# Altium schematic sheet Vapeix_mini_connector.SchDoc: Vapeix Mini PCB - Connectors
size A3; DrawnBy: Jon; Organization: Altium Limited; Address1: L3, 12a Rodborough Rd; Address2: Frenchs Forest; Address3: NSW; Address4: Australia 2086
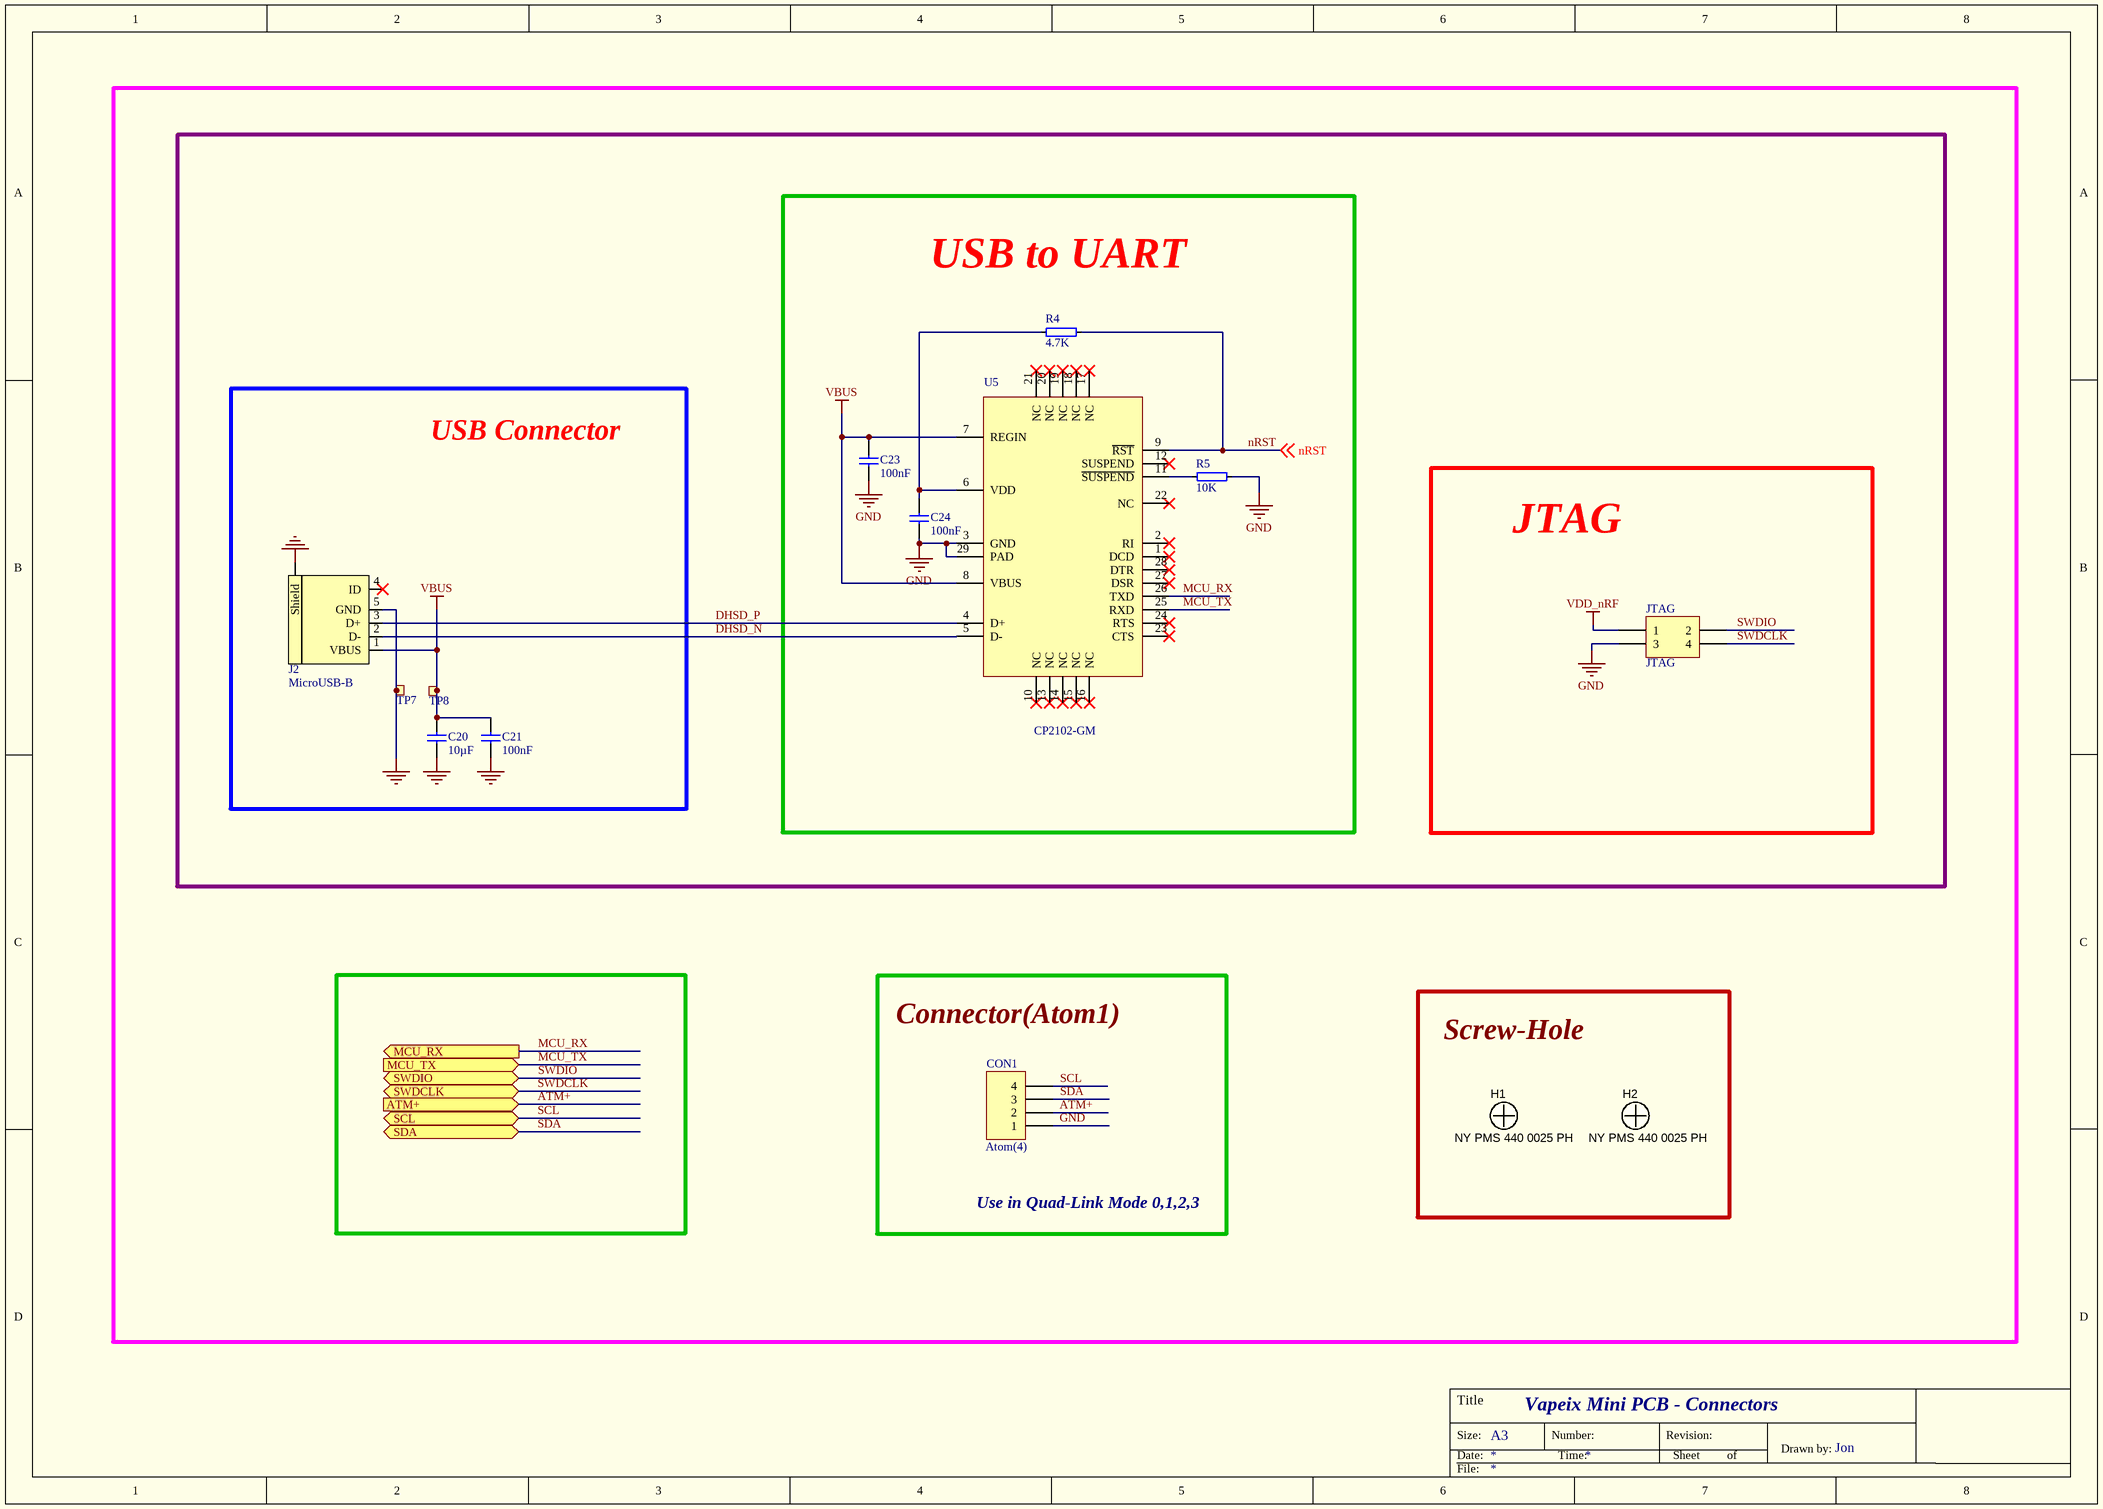
[diagram p0: Vapeix_mini_connector.SchDoc]

## Parts
C20  10µF  [C0201]
C21  100nF  [C0201]
C23  100nF  [C0201]
C24  100nF  [C0201]
CON1  Atom(4)  [S4B-PH-K-S]
H1  NY PMS 440 0025 PH  [SCREW_HOLE2]
H2  NY PMS 440 0025 PH  [SCREW_HOLE2]
J2  MicroUSB-B  [FCI_10118193-0001LF]
JTAG  JTAG  [CON4]
R4  4.7K  [R0201]
R5  10K  [C0201]
TP7  Ø1.0mm,SMD  [TP_SMD_Ø1.0mm]  (value not drawn)  (no BOM)
TP8  Ø1.0mm,SMD  [TP_SMD_Ø1.0mm]  (value not drawn)  (no BOM)
U5  CP2102-GM  [CP2102-GM]

## Ports
ATM+ (in), MCU_RX (out), MCU_TX (in), SCL (bidir), SDA (bidir), SWDCLK, SWDIO (bidir)

## Nets
GND: C20.1 C21.1 C23.1 C24.1 CON1.1 J2.5(GND) J2.6(Shield) JTAG.3 R5.2 TP7.1 U5.3(GND) U5.29(PAD)
VBUS: C20.2 C21.2 C23.2 J2.1(VBUS) TP8.1 U5.7(REGIN) U5.8(VBUS)
VDD_nRF: JTAG.1
ATM+: CON1.2 ; port ATM+
DHSD_N: J2.2(D-) U5.5(D-)
DHSD_P: J2.3(D+) U5.4(D+)
MCU_RX: U5.26(TXD) ; port MCU_RX
MCU_TX: U5.25(RXD) ; port MCU_TX
nRST: R4.2 U5.9(~{RST}) ; off-sheet nRST
SCL: CON1.4 ; port SCL
SDA: CON1.3 ; port SDA
SWDCLK: JTAG.4 ; port SWDCLK
SWDIO: JTAG.2 ; port SWDIO
NetC24_2: C24.2 R4.1 U5.6(VDD)
NetR5_1: R5.1 U5.11(~{SUSPEND})

Not connected (* = marked no-connect by the designer): J2 4(ID)*; U5 1(DCD)* 2(RI)* 10(NC)* 12(SUSPEND)* 13(NC)* 14(NC)* 15(NC)* 16(NC)* 17(NC)* 18(NC)* 19(NC)* 20(NC)* 21(NC)* 22(NC)* 23(CTS)* 24(RTS)* 27(DSR)* 28(DTR)*

## Notes on the sheet
- Labels drawn without touching a wire or pin: Connector(Atom1), JTAG, Screw-Hole, USB Connector, USB to UART, Use in Quad-Link Mode 0,1,2,3
- Title
- Size:
- Date:
- A3
- Number:
- Time:
- Revision:
- Sheet
- of
- Drawn by:
- File:

## Library data of the parts
C20 = C0603-10µ: Capacitor, X5R, ±20%; Note: 6.3V; Artikkelnr Noca: 20039234; Artikkelnr Simpro: N.A.; Part Number: C0603-10µ; Manufacturer: *; Manufacturer Part Number: *; Datasheet: *; LatestRevisionDate: 2011-01-17; Pin Count: 2; Publisher: Nordic Semiconductor; Published: 2011-01-17; Value: 10µF; Supplier: *; Supplier part number: *; 2nd source Supplier: *; 2nd source part number: *; Footprint Doc: 0603
C21 C23 C24 = C0402-100n: Capacitor, X7R, ±10%; Note: 16V; Artikkelnr Noca: 20039200; Artikkelnr Simpro: N.A.; Part Number: C0402-100n; Manufacturer: *; Manufacturer Part Number: *; Datasheet: *; LatestRevisionDate: 2009-11-23; Pin Count: 2; Publisher: Nordic Semiconductor; Published: 2009-05-08; Value: 100nF; Supplier: *; Supplier part number: *; 2nd source Supplier: *; 2nd source part number: *; Footprint Doc: 0402
CON1 = S4B-PH-K-S(LF)(SN): CONN HEADER PH SIDE 4POS 2MM; Manufacturer: JST Sales America Inc.; Connector Type: Header, Shrouded; Number of Positions: 4; Number of Positions Loaded: All; Pitch: 0.079" (2.00mm); Supplier 1: Digi-Key; Manufacturer Part Number: S4B-PH-K-S(LF)(SN); RoHS: RoHS Compliant; Category: Connectors, Interconnects; Stock 1: 41576; Pricing 1: 1=0.22, 10=0.208, 25=0.1772, 50=0.155, 100=0.144, 250=0.1274, 500=0.12186, 1000=0.0997, 2500=0.09139 (USD); Packaging: Bulk; Contact Type: Male Pin; Number of Rows: 1; Row Spacing: -; Contact Mating Length: 0.130" (3.30mm); Mounting Type: Through Hole, Right Angle; Termination: Press-Fit, Solder; Fastening Type: Detent Lock; Features: -; Contact Finish: Tin; Contact Finish Thickness: -; Color: Natural; ComponentLink1URL: http://www.jst-mfg.com/product/pdf/eng/ePH.pdf; ComponentLink1Description: http://www.jst-mfg.com/product/pdf/eng/ePH.pdf
H1 H2 = Screw-Hole: Machine Screw, Round, #4-40 x 1/4, Nylon, Philips panhead; Manufacturer: B&F Fastener Supply; Manufacturer Part Number: CP2102-GM; CompType: Hardware; SymbolCreator: codlsc; U/M: EA; USB Type: USB UART; USB Standard: USB 2.0; Supply Voltage Min: 3; Supply Voltage Max: 3.6; Interface Case Style: QFN; No. of Pins: 28; Data Rate: 1; No. of Ports: 1 Port; Base Number: 2102; Bridge Type: USB to UART; Supply Voltage Range: 3V to 5.25V<!--FANDB--><div class="features-and-benefits-container"><div class="features-and-benefits-desc-container"><span class="features-and-benefits-container-desc">USB to UART Bridge Controller in QFN-28 Package</span></div><div class="features-and-benefits-description"><span class="features-benefits-value">The CP2102-GM is a highly integrated USB to UART Bridge Controller providing a simple solution for updating RS-232 designs to USB using a minimum of components and PCB space. The CP2102-GM includes a USB 2.0 full speed function controller, USB transceiver, oscillator, EEPROM, and asynchronous serial data bus (UART) with full modem control signals. No other external USB components are required. The on chip EEPROM may be used to customise the USB Vendor ID, Product ID, Product Description String, Power Descriptor, Device Release Number, and Device Serial Number as desired for OEM applications. The EEPROM is programmed on board via the USB, allowing the programming step to be easily integrated into the product manufacturing and testing process.</span></div><div class="features-and-benefits-list"><ul class="features-and-benefits-list-list"><li class="features-and-benefits-list-item">Integrated USB transceiver; no external crystal required</li><li class="features-and-benefits-list-item">Integrated 1024 Byte EEPROM</li><li class="features-and-benefits-list-item">On chip power on reset circuit</li><li class="features-and-benefits-list-item">On chip voltage regulator: 3.3V output</li><li class="features-and-benefits-list-item">USB Specification 2.0 compliant; full-speed (12 Mbps)</li><li class="features-and-benefits-list-item">USB suspend states supported via SUSPEND pins</li><li class="features-and-benefits-list-item">All handshaking and modem interface signals</li><li class="features-and-benefits-list-item">Baud rates: 300 bps to 1 Mbits</li><li class="features-and-benefits-list-item">576 Byte receive buffer; SymbolVersion: 2009-10-28; MountType: N/A; RoHS: Y; PartNumber: NY PMS 440 0025 PH; PackageReference: Screw; DigiKeyPartNumber: H542-ND; ComponentLink1Description: Datasheet Link; ComponentLink1URL: http://www.fasnetdirect.com/refguide/Machinepancombo.pdf; ClassName: Mounting Holes; LatestRevisionDate: 2014-05-15; Publisher: Texas Instruments; Supplier 1: Digi-Key; Supplier Part Number 1: H542-ND; Supplier 4: Farnell; Stock 4: 9194; Pricing 4: 1=1.82, 10=1.72, 100=1.69, 250=1.66, 500=1.62, 2000=1.59, 3000=1.56, 5000=1.55 (GBP); Operating Temperature Min: -40; Operating Temperature Max: 85; Packaging: Each; MSL: -; Logic Function Number: 2102; Operating Temperature Range: -40°C to +85; ComponentLink2URL: http://www.farnell.com/datasheets/1694195.pdf; ComponentLink2Description: http://www.farnell.com/datasheets/1694195.pdf; Supplier Part Number 4: 9282130
J2 = FCI 10118193-0001LF: MicroUSB-B-SMT; Manufacturer: FCI; 2nd source part number: 649-10118193-0001LF; Artikkelnr Noca: N.A.; Part Number: FCI 10118193-0001LF; Manufacturer Part Number: 10118193-0001LF; Datasheet: http://portal.fciconnect.com/Comergent//fci/drawing/10118193.pdf; Footprint Doc: FCI_10118193-0001LF; LatestRevisionDate: 2014-10-07; Pin Count: 5; Publisher: Nordic Semiconductor; Published: 2014-10-07; Value: MicroUSB-B; Note: *; Supplier: Digi-Key; Supplier part number: 609-4616-1-ND; 2nd source Supplier: Mouser; Artikkelnr Simpro: N.A.
JTAG = Header 2X2: Header, 2-Pin, Dual row; LatestRevisionDate: 17-Jul-2002; LatestRevisionNote: Re-released for DXP Platform.; Publisher: Altium Limited
R4 = R0402-10k: Resistor, ±1%, 0.063W; Value: 10k; Note: Chip Res 1%; Artikkelnr Noca: 27049097; Artikkelnr Simpro: N.A.; Part Number: R0402-10k; Manufacturer: *; Manufacturer Part Number: *; Datasheet: *; LatestRevisionDate: 2009-11-23; Pin Count: 2; Publisher: Nordic Semiconductor; Published: 2009-05-08; Supplier: Farnell; Supplier part number: 173-8864; 2nd source Supplier: *; 2nd source part number: *; Footprint Doc: 0402
R5 = R0402-10k: Resistor, ±1%, 0.063W; Note: Chip Res 1%; Artikkelnr Noca: 27049097; Artikkelnr Simpro: N.A.; Value: 10k; Part Number: R0402-10k; Manufacturer: *; Manufacturer Part Number: *; Datasheet: *; LatestRevisionDate: 2009-11-23; Pin Count: 2; Publisher: Nordic Semiconductor; Published: 2009-05-08; Supplier: Farnell; Supplier part number: 173-8864; 2nd source Supplier: *; 2nd source part number: *; Footprint Doc: 0402
TP7 TP8 = TP_SMD_Ø1.0MM: 1.0mm circular SMD testpad; Manufacturer: Nordic Semiconductor; Artikkelnr Noca: N.A.; Part Number: TP_SMD_Ø1.0MM; Manufacturer Part Number: *; Datasheet: *; LatestRevisionDate: 2013-06-11; Pin Count: 1; Publisher: Nordic Semiconductor; Published: 2013-06-11; Value: Ø1.0mm,SMD; Note: *; Supplier: *; Supplier part number: *; 2nd source Supplier: *; 2nd source part number: *; Footprint Doc: TP_SMD_Ø1.0mm; Artikkelnr Simpro: N.A.
U5 = CP2102-GM: SILICON LABS - CP2102-GM - USB-TO-UART BRIDGE, 3.6V, MLP-28; USB Type: USB UART; USB Standard: USB 2.0; Supply Voltage Min: 3; Supply Voltage Max: 3.6; Interface Case Style: QFN; No. of Pins: 28; Data Rate: 1; No. of Ports: 1 Port; Base Number: 2102; Bridge Type: USB to UART; Supply Voltage Range: 3V to 5.25V<!--FANDB--><div class="features-and-benefits-container"><div class="features-and-benefits-desc-container"><span class="features-and-benefits-container-desc">USB to UART Bridge Controller in QFN-28 Package</span></div><div class="features-and-benefits-description"><span class="features-benefits-value">The CP2102-GM is a highly integrated USB to UART Bridge Controller providing a simple solution for updating RS-232 designs to USB using a minimum of components and PCB space. The CP2102-GM includes a USB 2.0 full speed function controller, USB transceiver, oscillator, EEPROM, and asynchronous serial data bus (UART) with full modem control signals. No other external USB components are required. The on chip EEPROM may be used to customise the USB Vendor ID, Product ID, Product Description String, Power Descriptor, Device Release Number, and Device Serial Number as desired for OEM applications. The EEPROM is programmed on board via the USB, allowing the programming step to be easily integrated into the product manufacturing and testing process.</span></div><div class="features-and-benefits-list"><ul class="features-and-benefits-list-list"><li class="features-and-benefits-list-item">Integrated USB transceiver; no external crystal required</li><li class="features-and-benefits-list-item">Integrated 1024 Byte EEPROM</li><li class="features-and-benefits-list-item">On chip power on reset circuit</li><li class="features-and-benefits-list-item">On chip voltage regulator: 3.3V output</li><li class="features-and-benefits-list-item">USB Specification 2.0 compliant; full-speed (12 Mbps)</li><li class="features-and-benefits-list-item">USB suspend states supported via SUSPEND pins</li><li class="features-and-benefits-list-item">All handshaking and modem interface signals</li><li class="features-and-benefits-list-item">Baud rates: 300 bps to 1 Mbits</li><li class="features-and-benefits-list-item">576 Byte receive buffer; Supplier 1: Farnell; Manufacturer: SILICON LABS; Manufacturer Part Number: CP2102-GM; RoHS: YES; Stock 1: 9194; Pricing 1: 1=1.82, 10=1.72, 100=1.69, 250=1.66, 500=1.62, 2000=1.59, 3000=1.56, 5000=1.55 (GBP); Operating Temperature Min: -40; Operating Temperature Max: 85; Packaging: Each; MSL: -; Logic Function Number: 2102; Operating Temperature Range: -40°C to +85; ComponentLink1URL: http://www.farnell.com/datasheets/1694195.pdf; ComponentLink1Description: http://www.farnell.com/datasheets/1694195.pdf; Supplier Part Number 1: 9282130